# EAGLE design Sudden_XCVR_Mic_Amp (EAGLE 9.2.2)
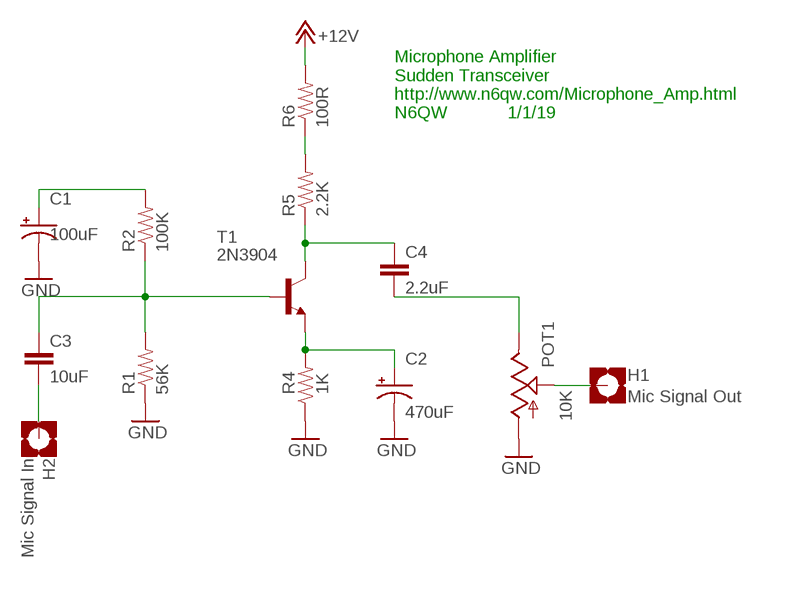
[diagram p0: schematic, sheet 1]

## Parts
C1  100uF  CAP-POLARIZED-RADIAL-2.5MM-25V-20%  [CAP-POLARIZED]
C2  470uF  CAP-POLARIZED-RADIAL-2.5MM-25V-20%  [CAP-POLARIZED]
C3  10uF  CAP-MEDIUM-MUPPET  [CAP-MEDIUM-MUPPET]
C4  2.2uF  CAP-MEDIUM-MUPPET  [CAP-MEDIUM-MUPPET]
H1  Mic Signal Out  MOUNT-PAD-SQUARE4.5  [PAD-SQUARE]
H2  Mic Signal In  MOUNT-PAD-SQUARE4.5  [PAD-SQUARE]
P+1  +12V  [POWER-IN-PAD]
POT1  10K  POTENTIOMETER-TRIMCT6  [POT-TRIMM-4]
R1  56K  RESISTOR-MUPPETMEDIUM-RESISTOR-PADS  [RESITOR-MUPPET]
R2  100K  RESISTOR-MUPPETMEDIUM-RESISTOR-PADS  [RESITOR-MUPPET]
R4  1K  RESISTOR-MUPPETMEDIUM-RESISTOR-PADS  [RESITOR-MUPPET]
R5  2.2K  RESISTOR-MUPPETMEDIUM-RESISTOR-PADS  [RESITOR-MUPPET]
R6  100R  RESISTOR-MUPPETMEDIUM-RESISTOR-PADS  [RESITOR-MUPPET]
T1  2N3904  [TO92]

## Nets
+12V: P+1.VCC(+12V) R6.P$2
GND: C1.2(-) C2.2(-) POT1.A R1.P$1 R4.P$1
N$1: C4.1 R5.P$1 T1.1(C)
N$2: C2.1(+) R4.P$2 T1.3(E)
N$3: C4.2 POT1.E
N$4: C3.1 R1.P$2 R2.P$1 T1.2(B)
N$5: C1.1(+) R2.P$2
N$6: R5.P$2 R6.P$1
N$7: H1.PAD(MOUNT) POT1.S
N$8: C3.2 H2.PAD(MOUNT)

## Notes on the sheet
- Microphone Amplifier
  Sudden Transceiver
  http://www.n6qw.com/Microphone_Amp.html
  N6QW            1/1/19

## Library data of the parts
C1 = jim_muppet_parts:CAP-POLARIZED: 100µF polarized capacitors A capacitor is a passive two-terminal electrical component used to store electrical energy temporarily in an electric field.; PROD_ID: CAP-08439
C2 = jim_muppet_parts:CAP-POLARIZED: 100µF polarized capacitors A capacitor is a passive two-terminal electrical component used to store electrical energy temporarily in an electric field.; PROD_ID: CAP-08439; VALUE: 100uF
C3 C4 = jim_muppet_parts:CAP-MEDIUM-MUPPET: Capacitor - Muppet style - Medium size SMT Pads 120 square SMT pads; PROD_ID: JIM-CAP Large SMT; VALUE: Set 0.0uF
H1 H2 = jim_muppet_parts:MOUNT-PAD-SQUARE: MOUNTING PAD, square
P+1 = jim_muppet_parts:+12V: SUPPLY SYMBOL
POT1 = jim_muppet_parts:POTENTIOMETER-TRIM: POTENTIOMETER
R1 R2 R4-R6 = jim_muppet_parts:RESISTOR-MUPPET: Muppet stype resitor 120 square pad; PROD_ID: MUP-RES; VALUE: ohm
T1 = jim_muppet_parts:2N3904: NPN TRANSISTOR

## Board
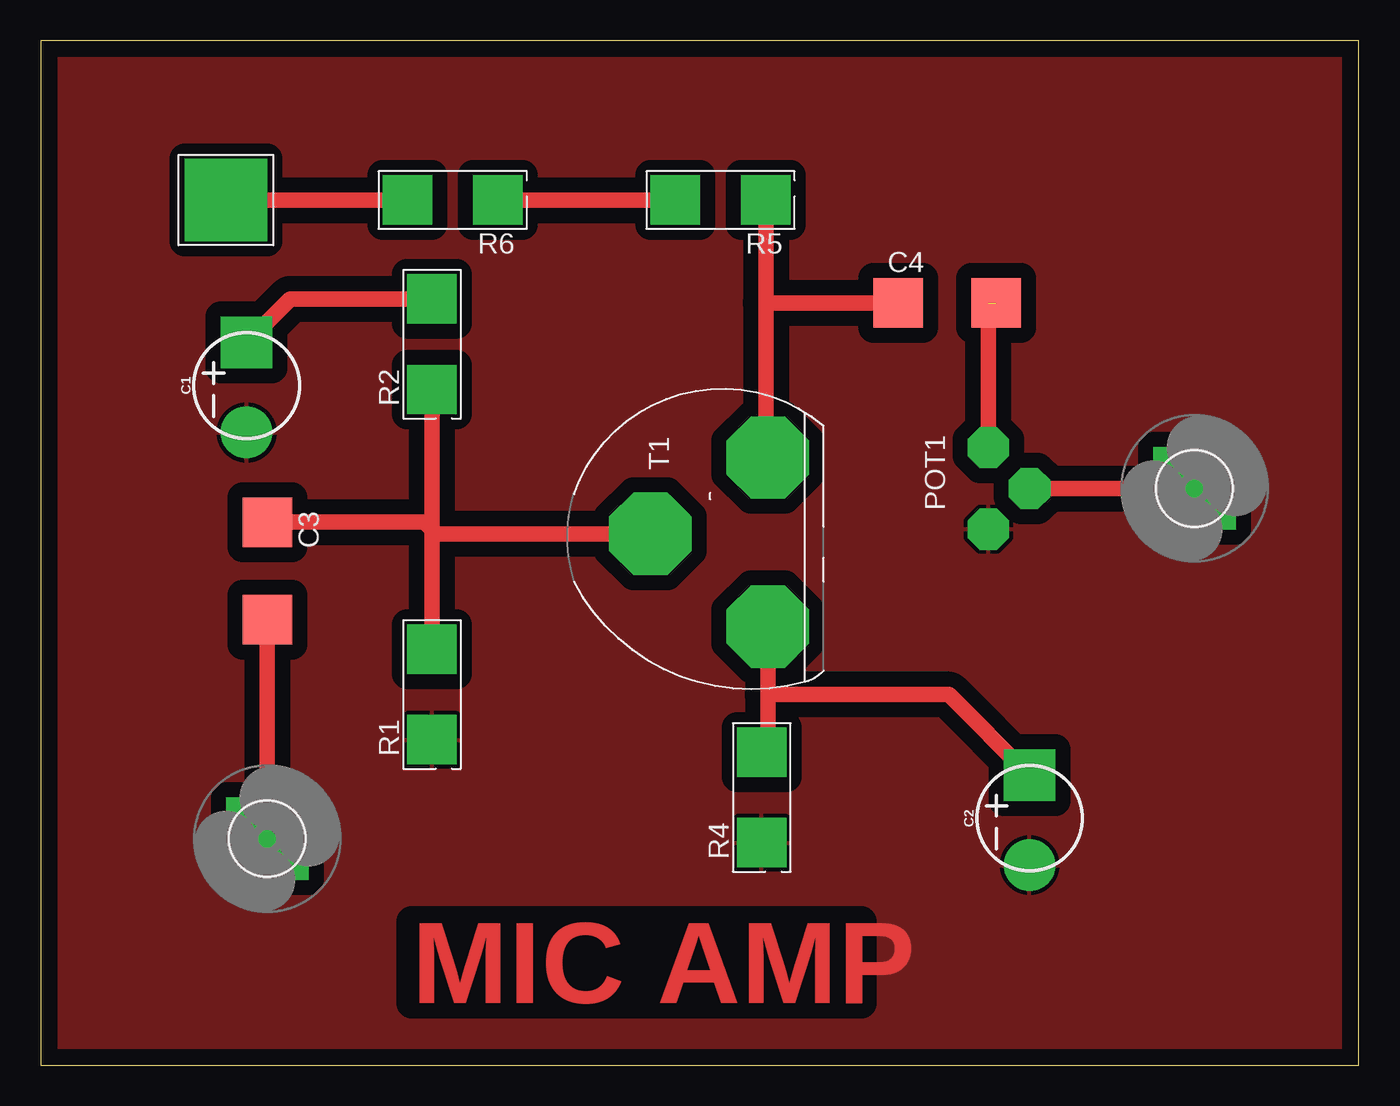
[diagram p1: board, top side]
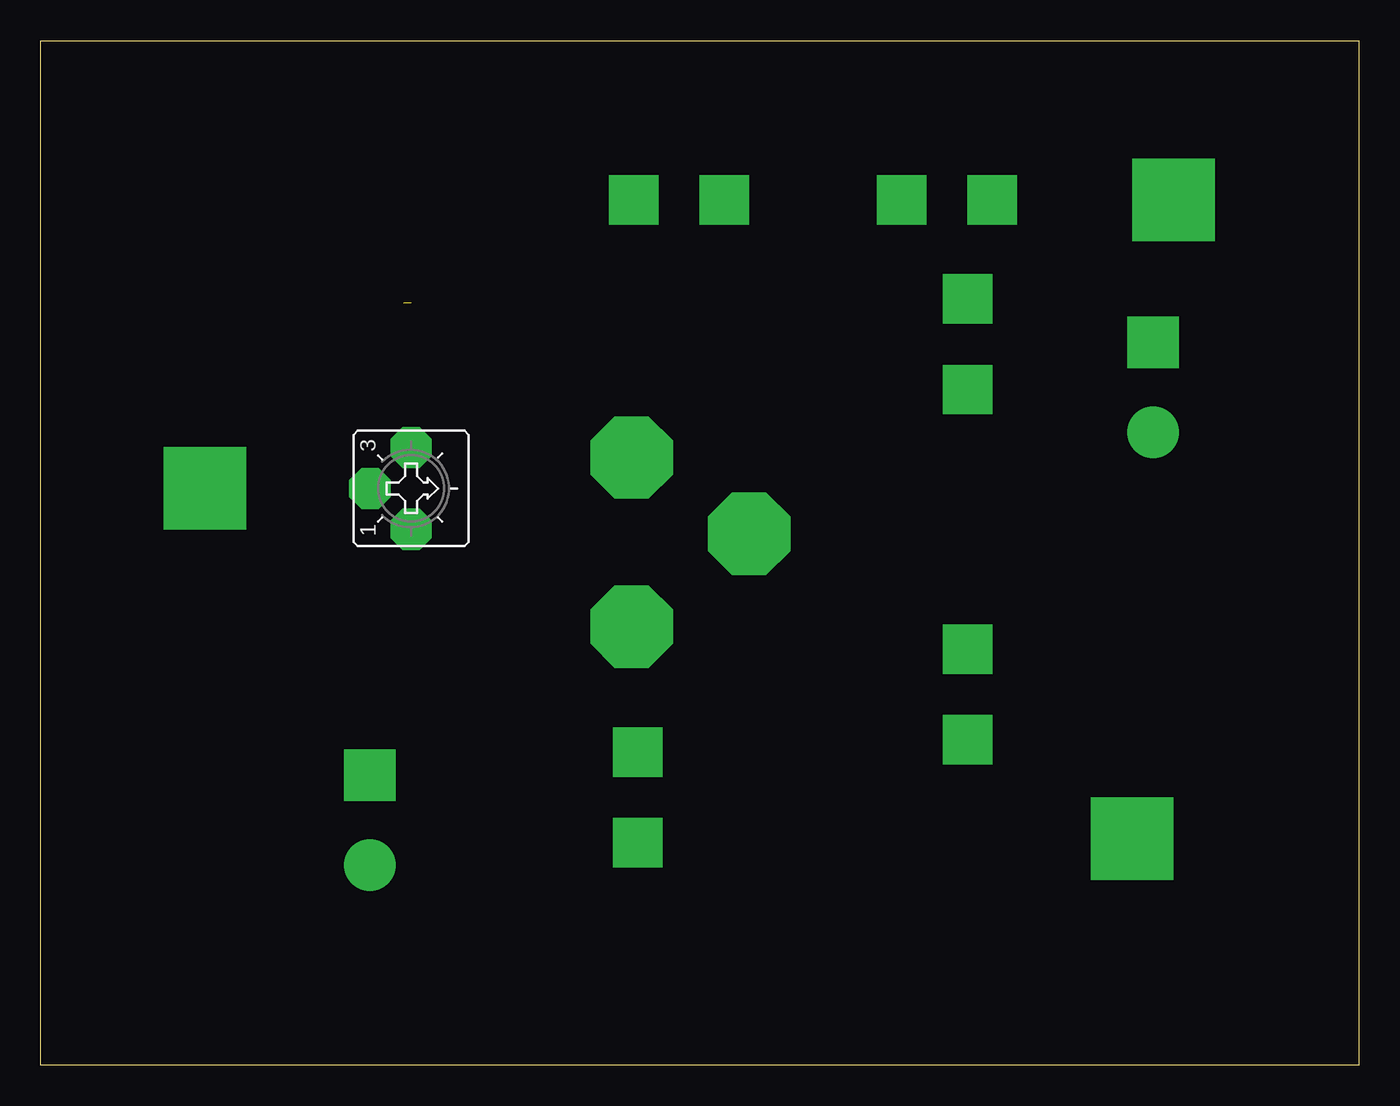
[diagram p2: board, bottom side, seen from below]

Size 81.26 x 63.17 mm. Coordinates in mm from the lower left corner, seen from the top.
Outline: 0,0 81.26,0 81.26,63.17 0,63.17 0,0
Copper layers (1*16): Top 0.035mm / dielectric 1.5mm / Bottom 0.035mm
Design rules "default": minimum track width 6mil, minimum drill 0.35mm, track to track 6mil, track to pad 6mil, pad to pad 6mil, via to via 6mil, smd to smd 6mil, copper to edge 40mil, drill to drill 6mil, minimum pad ring 10mil, minimum via ring 8mil, stop-mask expansion 4mil, vias tented up to drill 0mil, thermal gap 10mil

### Footprints (pad centres in the part's own frame; a part is rotated, then mirrored left to right if it is on the bottom)
CAP-POLARIZED = drill 0 pad 3.175 square: 1 2.647,0 | drill 0 pad 3.175: 2 -2.901,0
CAP-MEDIUM-MUPPET = smd 3.048 x 3.048: 1 -3.009,0; 2 3.009,0
PAD-SQUARE = drill 0 pad 5.08 square: PAD 0,0
POWER-IN-PAD = drill 0 pad 5.08 square: VCC 0,0
POT-TRIMM-4 = drill 0 pad 2.54 octagon: A 2.515,0; E -2.515,0; S 0,-2.54
RESITOR-MUPPET = drill 0 pad 3.048 square: P$1 -2.794,0; P$2 2.794,0
TO92 = drill 0 pad 5.08 octagon: 1 5.715,-4.191; 2 1.016,3.048; 3 -4.699,-4.191

### Placement (x,y rotation side)
C1  12.7,41.91 90 top
C2  60.96,15.24 90 top
C3  13.97,30.48 270 top
C4  55.88,46.99 0 top
H1  71.12,35.56 0 top
H2  13.97,13.97 0 top
P+1  11.43,53.34 0 top
POT1  58.42,35.56 270 bottom
R1  24.13,22.86 90 top
R2  24.13,44.45 90 top
R4  44.45,16.51 90 top
R5  41.91,53.34 180 top
R6  25.4,53.34 180 top
T1  40.64,31.75 90 top

### Tracks (layer width: path | path; a pad name or v marks a point on that pad's centre or on a via)
+12V
  Top 0.94: P+1.VCC R6.P$2
GND
  pour Top: 0,0 0,63.5 81.28,63.5 81.28,0
N$1
  Top 0.94: R5.P$1 44.7,46.99 | 44.7,46.99 44.7,37.59 T1.1 | C4.1 44.7,46.99
N$2
  Top 0.94: T1.3 44.83,22.86 | 44.83,22.86 44.83,19.68 R4.P$2 | C2.1 55.99,22.86 44.83,22.86
N$3  (1 unrouted)
  Top 0.94: POT1.E 58.42,46.99
N$4
  Top 0.94: R1.P$2 24.13,33.02 | 24.13,33.02 R2.P$1 | T1.2 24.38,32.77 24.13,33.02 | C3.1 23.66,33.49 24.13,33.02
N$5
  Top 0.94: R2.P$2 15.39,47.24 C1.1
N$6
  Top 0.94: R6.P$1 R5.P$2
N$7
  Top 0.94: POT1.S H1.PAD
N$8
  Top 0.94: C3.2 H2.PAD

### Text on the board
Top: MIC AMP